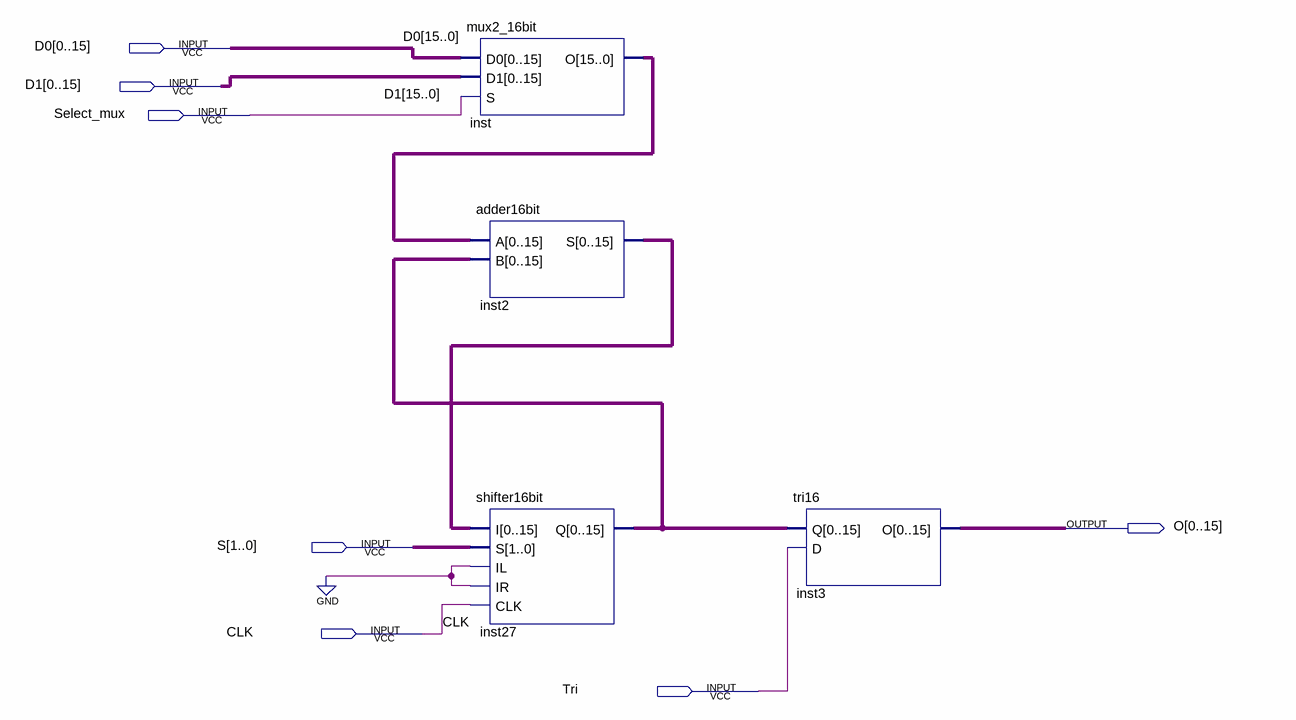
[diagram p0: schematic sheet]
// Quartus schematic lab04.bdf as structural Verilog: 4 symbols, 7 pins
module lab04 (
  input  [0:15] D0,
  input  [0:15] D1,
  input  Select_mux,
  input  [1:0] S,
  input  CLK,
  input  Tri,
  output [0:15] O
);

  wire [15:0] inst2_s, inst27_q, inst_o;

  mux2_16bit inst (
    .D0({D0[15], D0[14], D0[13], D0[12], D0[11], D0[10], D0[9], D0[8], D0[7], D0[6], D0[5], D0[4], D0[3], D0[2], D0[1], D0[0]}),
    .D1({D1[15], D1[14], D1[13], D1[12], D1[11], D1[10], D1[9], D1[8], D1[7], D1[6], D1[5], D1[4], D1[3], D1[2], D1[1], D1[0]}),
    .S(Select_mux), .O(inst_o));
  adder16bit inst2 (.A(inst_o), .B(inst27_q), .S(inst2_s));
  shifter16bit inst27 (.I(inst2_s), .S(S), .IL(1'b0), .IR(1'b0), .CLK(CLK), .Q(inst27_q));
  tri16 inst3 (.Q(inst27_q), .D(Tri), .O(O));
endmodule
